# EAGLE design ARDUINOMAINCONTROL (EAGLE 9.3.1)
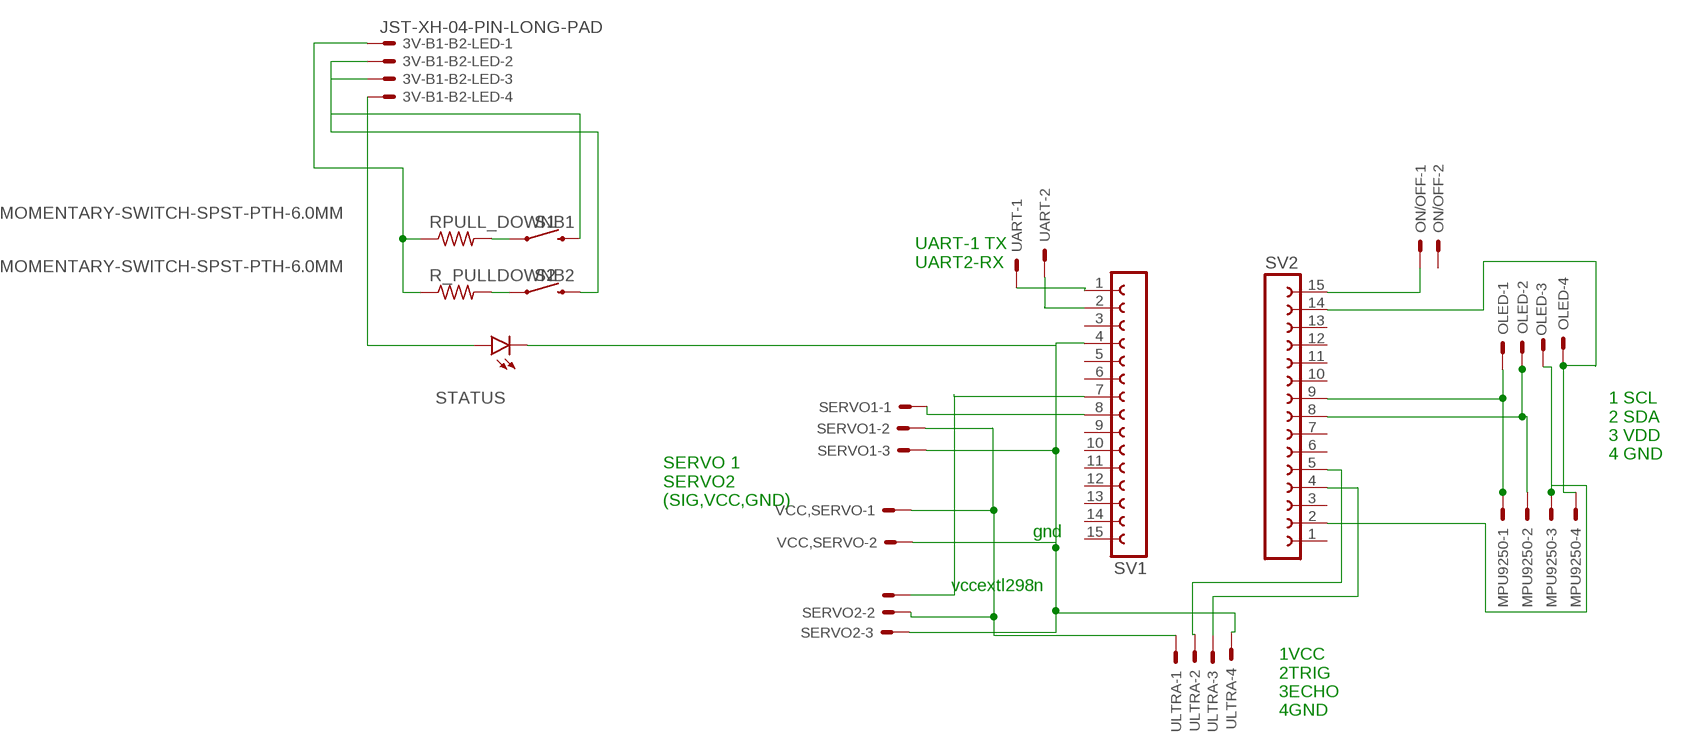
[diagram p0: schematic, sheet 1]

## Parts
3V-B1-B2-LED  JST-XH-04-PIN-LONG-PAD  [JST-XH-04-PACKAGE-LONG-PAD]
MPU9250  JST-XH-04-PIN-LONG-PAD  [JST-XH-04-PACKAGE-LONG-PAD]
OLED  JST-XH-04-PIN-LONG-PAD  [JST-XH-04-PACKAGE-LONG-PAD]
ON/OFF  JST-XH-02-PIN-LONG-PAD  [JST-XH-02-PACKAGE-LONG-PAD]
R_PULLDOWNB2  R-US_0207/10  [0207/10]
RPULL_DOWNB1  R-US_0207/10  [0207/10]
S1  MOMENTARY-SWITCH-SPST-PTH-6.0MM  [TACTILE_SWITCH_PTH_6.0MM]
S2  MOMENTARY-SWITCH-SPST-PTH-6.0MM  [TACTILE_SWITCH_PTH_6.0MM]
SERVO1  JST-XH-03-PIN-LONG-PAD  [JST-XH-03-PACKAGE-LONG-PAD]
SERVO2  JST-XH-03-PIN-LONG-PAD  [JST-XH-03-PACKAGE-LONG-PAD]
STATUS  LED3MM  [LED3MM]
SV1  FE15-1  [FE15]
SV2  FE15-1  [FE15]
UART  JST-XH-02-PIN-LONG-PAD  [JST-XH-02-PACKAGE-LONG-PAD]
ULTRA  JST-XH-04-PIN-LONG-PAD  [JST-XH-04-PACKAGE-LONG-PAD]
VCC,SERVO  JST-XH-02-PIN-LONG-PAD  [JST-XH-02-PACKAGE-LONG-PAD]

## Nets
N$2: MPU9250.1 OLED.1 SV2.9
N$3: MPU9250.3 OLED.3 SV2.2
N$4: MPU9250.4 OLED.4 SV2.14
N$5: ON/OFF.1 SV2.15
N$6: SV1.1 UART.1
N$7: SV1.2 UART.2
N$8: SERVO1.3 STATUS.K(C) SV1.4 ULTRA.4 VCC,SERVO.2
N$9: SERVO1.2 ULTRA.1 VCC,SERVO.1
N$10: SV2.4 ULTRA.3
N$11: SV2.5 ULTRA.2
N$12: RPULL_DOWNB1.2 S1.1
N$13: R_PULLDOWNB2.2 S2.1
N$14: SERVO1.1 SV1.8
N$15: SERVO2.1 SV1.7
N$16: 3V-B1-B2-LED.1 R_PULLDOWNB2.1 RPULL_DOWNB1.1
N$17: 3V-B1-B2-LED.2 S1.3
N$18: 3V-B1-B2-LED.3 S2.3
N$19: 3V-B1-B2-LED.4 STATUS.A
N$20: SERVO2.2
N$21: SERVO2.3
N$23: MPU9250.2 OLED.2 SV2.8
Unconnected: ON/OFF.2 SV1.3 SV1.5 SV1.6 SV1.9 SV1.10 SV1.11 SV1.12 SV1.13 SV1.14 SV1.15 SV2.1 SV2.3 SV2.6 SV2.7 SV2.10 SV2.11 SV2.12 SV2.13

## Notes on the sheet
- UART-1 TX
  UART2-RX
- 1 SCL
  2 SDA
  3 VDD 
  4 GND
- SERVO 1
  SERVO2
  (SIG,VCC,GND)
- gnd
- vccextl298n
- 1VCC
  2TRIG
  3ECHO
  4GND

## Library data of the parts
3V-B1-B2-LED MPU9250 OLED ULTRA = Rembrandt Electronics - JST XH Connectors v1-0:JST-XH-04-PIN: JST XH Connector 2 Pin Wire to board connector. Pitch: 2,54 mm, (0.100") Number of pins: 4 Created by Rembrandt Electronics www.rembrandtelectronics.com
ON/OFF UART VCC,SERVO = Rembrandt Electronics - JST XH Connectors v1-0:JST-XH-02-PIN: JST XH Connector 2 Pin Wire to board connector. Pitch: 2,54 mm, (0.100") Number of pins: 2 Created by Rembrandt Electronics www.rembrandtelectronics.com
R_PULLDOWNB2 RPULL_DOWNB1 = rcl:R-US_: RESISTOR, American symbol; SPICEPREFIX: R
S1 S2 = SparkFun-Switches:MOMENTARY-SWITCH-SPST: Momentary Switch (Pushbutton) - SPST Normally-open (NO) SPST momentary switches (buttons, pushbuttons). Variants PTH-12MM - 12mm square, through-hole Momentary Pushbutton Switch - 12mm Square <https://www.sparkfun.com/products/9190> (COM-09190) PTH-6.0MM, PTH-6.0MM-KIT - 6.0mm square, through-hole Mini Pushbutton Switch <https://www.sparkfun.com/products/97> (COM-00097) KIT package intended for soldering kit's - only one side of pads' copper is exposed. PTH-RIGHT-ANGLE-KIT - Right-angle, through-hole Right Angle Tactile Button <https://www.sparkfun.com/products/10791> - Used on SparkFun BigTime Watch Kit <https://www.sparkfun.com/products/11734> SMD-12MM - 12mm square, surface-mount Tactile Button - SMD (12mm) <https://www.sparkfun.com/products/12993> (COM-12993) Used on SparkFun PicoBoard <https://www.sparkfun.com/products/11888> SMD-4.5MM - 4.5mm Square Trackball Switch Used on SparkFun Blackberry Trackballer Breakout <https://www.sparkfun.com/products/13169> SMD-4.6MMX2.8MM - 4.60mm x 2.80mm, surface mount Used on SparkFun SAMD21 Mini Breakout <https://www.sparkfun.com/products/13664> SMD-5.2MM, SMD-5.2-REDUNDANT - 5.2mm square, surface-mount Mini Pushbutton Switch - SMD <https://www.sparkfun.com/products/8720> (COM-08720) Used on Arduino Pro Mini <https://www.sparkfun.com/products/11114> REDUNDANT package connects both switch circuits together SMD-6.0X3.5MM - 6.0 x 3.5mm, surface mount Momentary Reset Switch SMD <https://www.sparkfun.com/products/8229> (COM-08229) SMD-6.2MM-TALL - 6.2mm square, surface mount Tactile Button - SMD (6mm) <https://www.sparkfun.com/products/12992> Used on SparkFun Digital Sandbox <https://www.sparkfun.com/products/12651> SMD-RIGHT-ANGLE - Right-angle, surface mount Used on SparkFun Block for Intel® Edison - Arduino <https://www.sparkfun.com/products/13036>; PROD_ID: SWCH-08441; SF_SKU: COM-00097
SERVO1 SERVO2 = Rembrandt Electronics - JST XH Connectors v1-0:JST-XH-03-PIN: JST XH Connector 2 Pin Wire to board connector. Pitch: 2,54 mm, (0.100") Number of pins: 3 Created by Rembrandt Electronics www.rembrandtelectronics.com
STATUS = led:LED: LED OSRAM: - CHIPLED LG R971, LG N971, LY N971, LG Q971, LY Q971, LO R971, LY R971 LH N974, LH R974 LS Q976, LO Q976, LY Q976 LO Q996 - Hyper CHIPLED LW Q18S LB Q993, LB Q99A, LB R99A - SideLED LS A670, LO A670, LY A670, LG A670, LP A670 LB A673, LV A673, LT A673, LW A673 LH A674 LY A675 LS A676, LA A676, LO A676, LY A676, LW A676 LS A679, LY A679, LG A679 - Hyper Micro SIDELED® LS Y876, LA Y876, LO Y876, LY Y876 LT Y87S - SmartLED LW L88C, LW L88S LB L89C, LB L89S, LG L890 LS L89K, LO L89K, LY L89K LS L896, LA L896, LO L896, LY L896 - TOPLED LS T670, LO T670, LY T670, LG T670, LP T670 LSG T670, LSP T670, LSY T670, LOP T670, LYG T670 LG T671, LOG T671, LSG T671 LB T673, LV T673, LT T673, LW T673 LH T674 LS T676, LA T676, LO T676, LY T676, LB T676, LH T676, LSB T676, LW T676 LB T67C, LV T67C, LT T67C, LS T67K, LO T67K, LY T67K, LW E67C LS E67B, LA E67B, LO E67B, LY E67B, LB E67C, LV E67C, LT E67C LW T67C LS T679, LY T679, LG T679 LS T770, LO T770, LY T770, LG T770, LP T770 LB T773, LV T773, LT T773, LW T773 LH T774 LS E675, LA E675, LY E675, LS T675 LS T776, LA T776, LO T776, LY T776, LB T776 LHGB T686 LT T68C, LB T68C - Hyper Mini TOPLED® LB M676 - Mini TOPLED Santana® LG M470 LS M47K, LO M47K, LY M47K Source: http://www.osram.convergy.de LUXEON: - LUMILED® LXK2-PW12-R00, LXK2-PW12-S00, LXK2-PW14-U00, LXK2-PW14-V00 LXK2-PM12-R00, LXK2-PM12-S00, LXK2-PM14-U00 LXK2-PE12-Q00, LXK2-PE12-R00, LXK2-PE12-S00, LXK2-PE14-T00, LXK2-PE14-U00 LXK2-PB12-K00, LXK2-PB12-L00, LXK2-PB12-M00, LXK2-PB14-N00, LXK2-PB14-P00, LXK2-PB14-Q00 LXK2-PR12-L00, LXK2-PR12-M00, LXK2-PR14-Q00, LXK2-PR14-R00 LXK2-PD12-Q00, LXK2-PD12-R00, LXK2-PD12-S00 LXK2-PH12-R00, LXK2-PH12-S00 LXK2-PL12-P00, LXK2-PL12-Q00, LXK2-PL12-R00 Source: www.luxeon.com KINGBRIGHT: KA-3528ASYC Source: www.kingbright.com
SV1 SV2 = con-lsta:FE15-1: FEMALE HEADER; OC_FARNELL: unknown; OC_NEWARK: unknown

## Net classes
0 OPTIBOARD: width 0.75 mm, drill 2.99 mm, clearance 0.8 mm

## Board
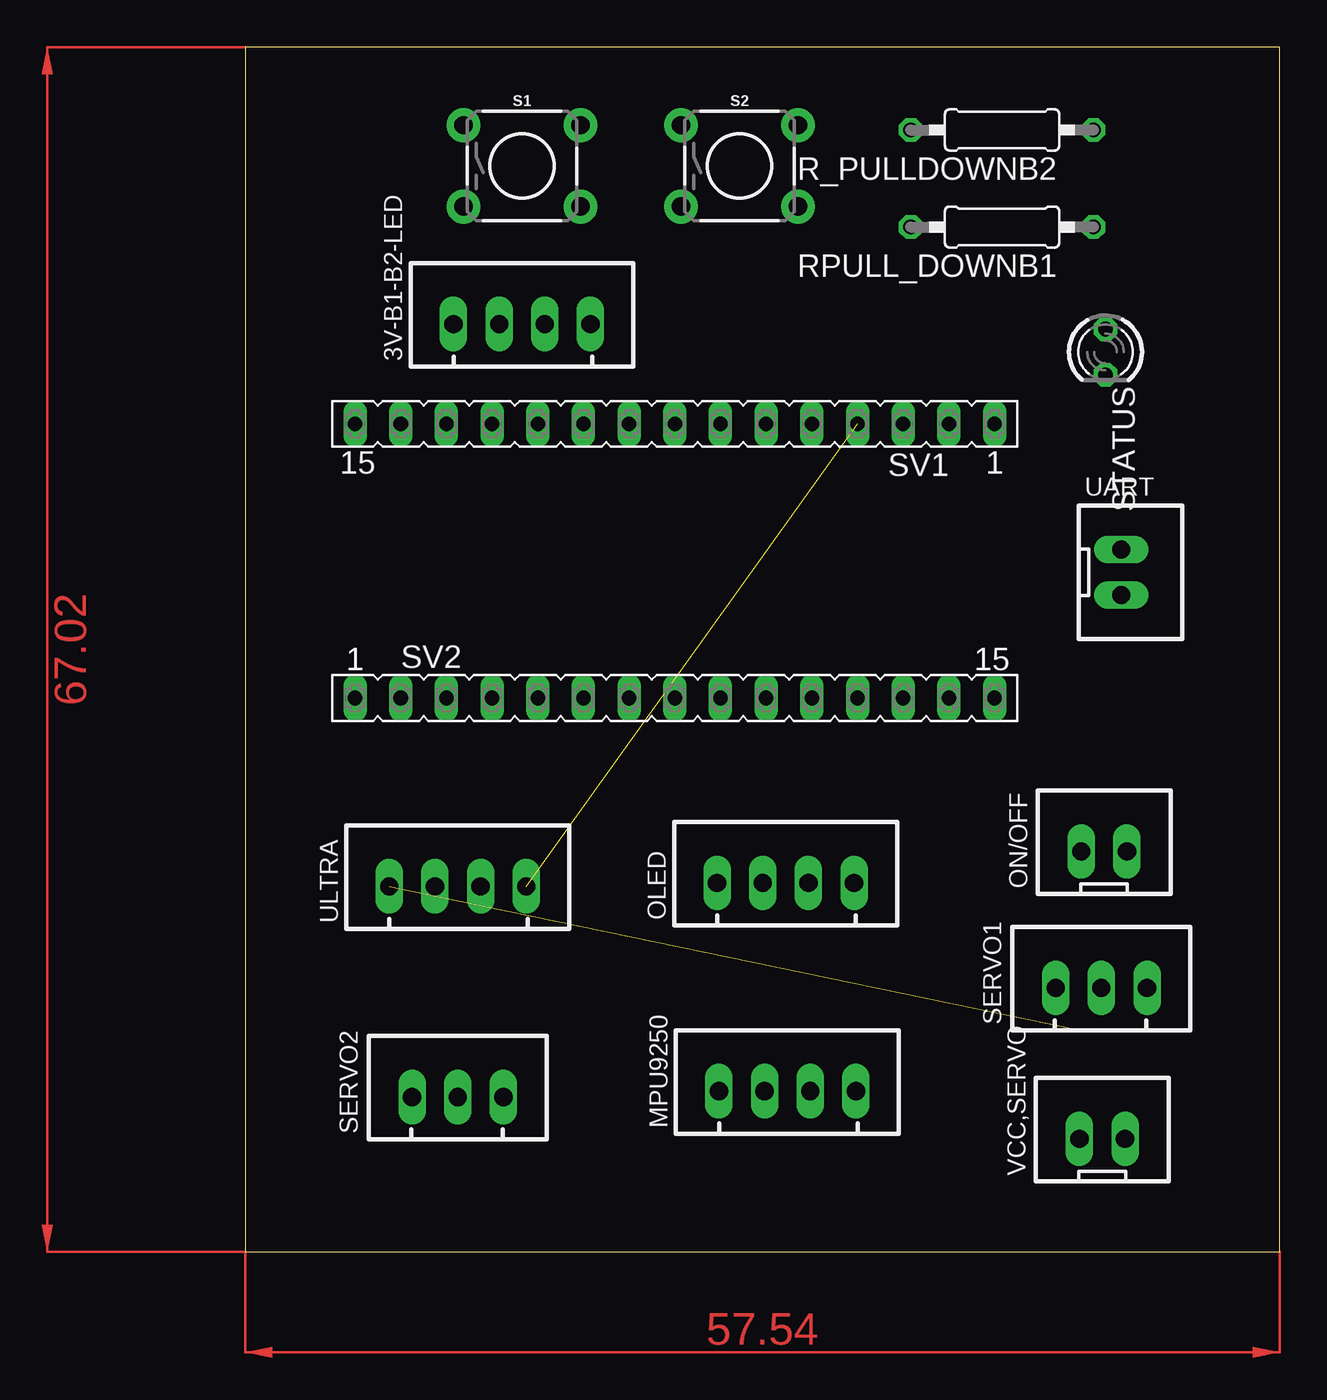
[diagram p1: board, top side]
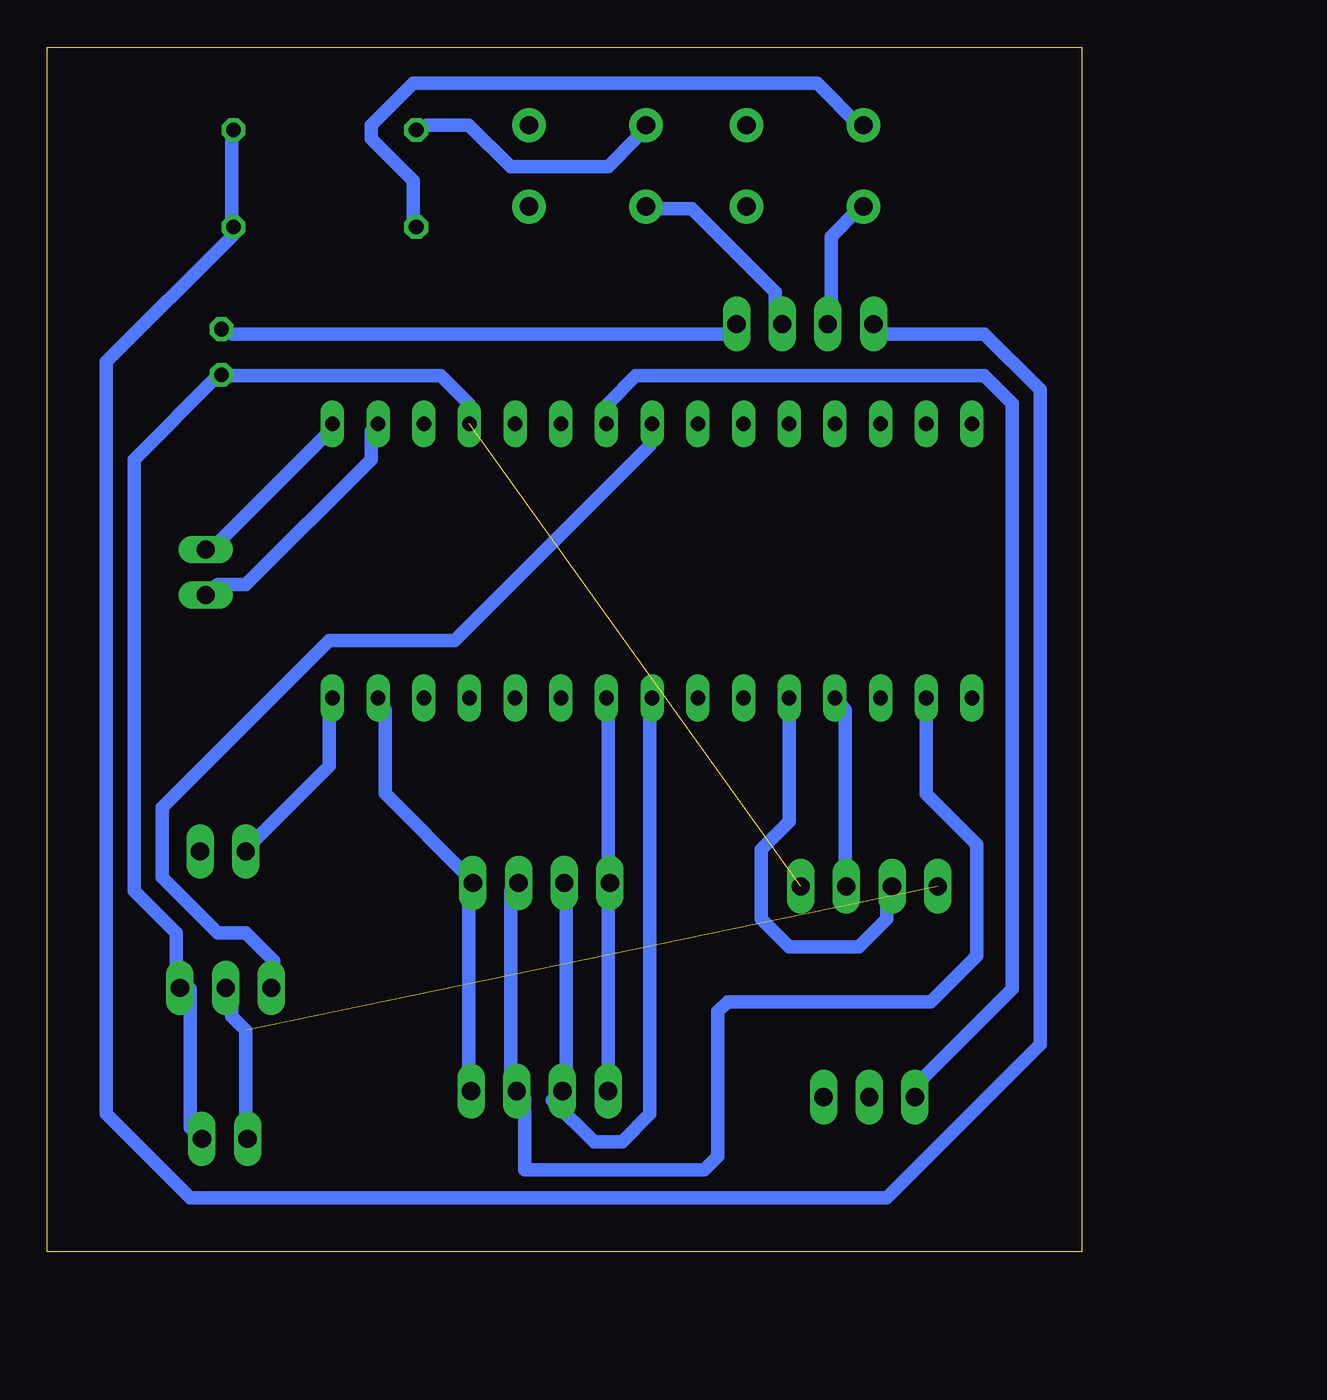
[diagram p2: board, bottom side, seen from below]

Size 57.54 x 67.02 mm. Coordinates in mm from the lower left corner, seen from the top.
Outline: 0,0 57.54,0 57.54,67.02 0,67.02 0,0
Copper layers (1*16): Top 0.035mm / dielectric 1.5mm / Bottom 0.035mm
Design rules "default": minimum track width 6mil, minimum drill 0.35mm, track to track 6mil, track to pad 6mil, pad to pad 6mil, via to via 6mil, smd to smd 6mil, copper to edge 40mil, drill to drill 6mil, minimum pad ring 10mil, minimum via ring 8mil, stop-mask expansion 4mil, vias tented up to drill 0mil, thermal gap 10mil

### Footprints (pad centres in the part's own frame; a part is rotated, then mirrored left to right if it is on the bottom)
JST-XH-04-PACKAGE-LONG-PAD = drill 1.016 long: 1 -3.81,0; 2 -1.27,0; 3 1.27,0; 4 3.81,0
JST-XH-02-PACKAGE-LONG-PAD = drill 1.016 long: 1 -1.27,0; 2 1.27,0
0207/10 = drill 0.813 octagon: 1 -5.08,0; 2 5.08,0
TACTILE_SWITCH_PTH_6.0MM = drill 1.016 pad 1.88: 1 -3.251,2.261; 2 3.251,2.261; 3 -3.251,-2.261; 4 3.251,-2.261
JST-XH-03-PACKAGE-LONG-PAD = drill 1.016 long: 1 -2.54,0; 2 0,0; 3 2.54,0
LED3MM = drill 0.813 octagon: A -1.27,0; K 1.27,0
FE15 = drill 0.813 long: 1 -17.78,0; 2 -15.24,0; 3 -12.7,0; 4 -10.16,0; 5 -7.62,0; 6 -5.08,0; 7 -2.54,0; 8 0,0; 9 2.54,0; 10 5.08,0; 11 7.62,0; 12 10.16,0; 13 12.7,0; 14 15.24,0; 15 17.78,0

### Placement (x,y rotation side)
3V-B1-B2-LED  15.4,51.62 0 top
MPU9250  30.16,8.94 0 top
OLED  30.06,20.53 0 top
ON/OFF  47.77,22.28 0 top
R_PULLDOWNB2  42.1,62.42 180 top
RPULL_DOWNB1  42.1,57.02 180 top
S1  15.4,60.42 0 top
S2  27.5,60.42 0 top
SERVO1  47.62,14.69 0 top
SERVO2  11.83,8.62 0 top
STATUS  47.85,50.07 270 top
SV1  23.9,46.07 180 top
SV2  23.9,30.82 0 top
UART  48.73,37.81 270 top
ULTRA  11.83,20.34 0 top
VCC,SERVO  47.67,6.29 0 top

### Tracks (layer width: path | path; a pad name or v marks a point on that pad's centre or on a via)
N$2
  Bottom 0.75: SV2.9 26.35,30.15 26.35,20.85 OLED.1 26.35,20.07 MPU9250.1
N$3
  Bottom 0.75: OLED.3 31.77,20.07 31.77,9.22 MPU9250.3 31,8.51 31,8.49 31.04,7.9 31,7.86 31,4.57 21,4.57 20.25,5.32 20.25,13.37 19.7,13.92 8.4,13.92 5.85,16.47 5.85,22.67 8.66,25.48 SV2.2
N$4
  Bottom 0.75: SV2.14 38.75,30.15 38.75,25.5 34.1,20.85 OLED.4 34.1,20.07 34.1,9.22 MPU9250.4
N$5
  Bottom 0.75: SV2.15 41.85,30.15 41.85,27.05 46.5,22.4 ON/OFF.1
N$6
  Bottom 0.75: SV1.1 41.85,45.65 48.05,39.45 UART.1
N$7
  Bottom 0.75: SV1.2 39.52,45.65 39.52,44.09 46.5,37.12 48.05,37.12 UART.2
N$8  (1 unrouted)
  Bottom 0.75: VCC,SERVO.2 49.6,6.89 49.6,14.64 SERVO1.3 50.38,15.42 50.38,17.75 52.7,20.07 52.7,44.09 48.05,48.75 STATUS.K 47.27,48.75 35.65,48.75 34.1,47.2 34.1,46.42 SV1.4
N$9  (1 unrouted)
  Bottom 0.75: VCC,SERVO.1 46.5,6.89 46.5,12.32 47.27,13.1 47.27,14.64 SERVO1.2
N$10
  Bottom 0.75: SV2.4 13.18,30.15 13.18,20.85 ULTRA.3
N$11
  Bottom 0.75: SV2.5 16.27,30.15 16.27,23.95 17.82,22.4 17.82,18.52 16.27,16.97 12.4,16.97 10.85,18.52 10.85,20.07 ULTRA.2
N$12
  Bottom 0.75: RPULL_DOWNB1.2 37.2,57.27 37.2,59.59 39.52,61.92 39.52,62.7 37.2,65.02 14.72,65.02 12.4,62.7 S1.1
N$13
  Bottom 0.75: R_PULLDOWNB2.2 36.42,62.7 34.1,62.7 31.77,60.37 26.35,60.37 24.8,61.92 S2.1
N$14
  Bottom 0.75: SV1.8 24.02,45.65 24.02,44.87 34.88,34.02 41.85,34.02 51.15,24.72 51.15,20.85 48.05,17.75 46.5,17.75 44.95,16.2 44.95,15.42 SERVO1.1
N$15
  Bottom 0.75: SV1.7 26.35,46.42 26.35,47.2 24.8,48.75 5.42,48.75 3.88,47.2 3.88,14.64 9.3,9.22 SERVO2.1
N$16
  Bottom 0.75: R_PULLDOWNB2.1 47.27,61.92 47.27,57.27 RPULL_DOWNB1.1 47.27,56.5 54.25,49.52 54.25,7.67 49.6,3.02 10.85,3.02 2.33,11.54 2.33,47.97 5.42,51.07 10.85,51.07 3V-B1-B2-LED.1
N$17
  Bottom 0.75: 3V-B1-B2-LED.2 13.95,51.84 13.95,56.5 12.4,58.05 S1.3
N$18
  Bottom 0.75: 3V-B1-B2-LED.3 17.05,51.84 17.05,53.4 21.7,58.05 24.02,58.05 S2.3
N$19
  Bottom 0.75: STATUS.A 47.27,51.07 19.38,51.07 3V-B1-B2-LED.4
N$23
  Bottom 0.75: SV2.8 24.02,30.15 24.02,7.67 25.57,6.12 27.12,6.12 29.45,8.45 MPU9250.2 28.68,9.22 28.68,20.07 OLED.2
(copper drawn outside any net)
  shapes: Top area x2